# Altium schematic sheet MT-PowerDivider V1.0.0.SchDoc
size A2
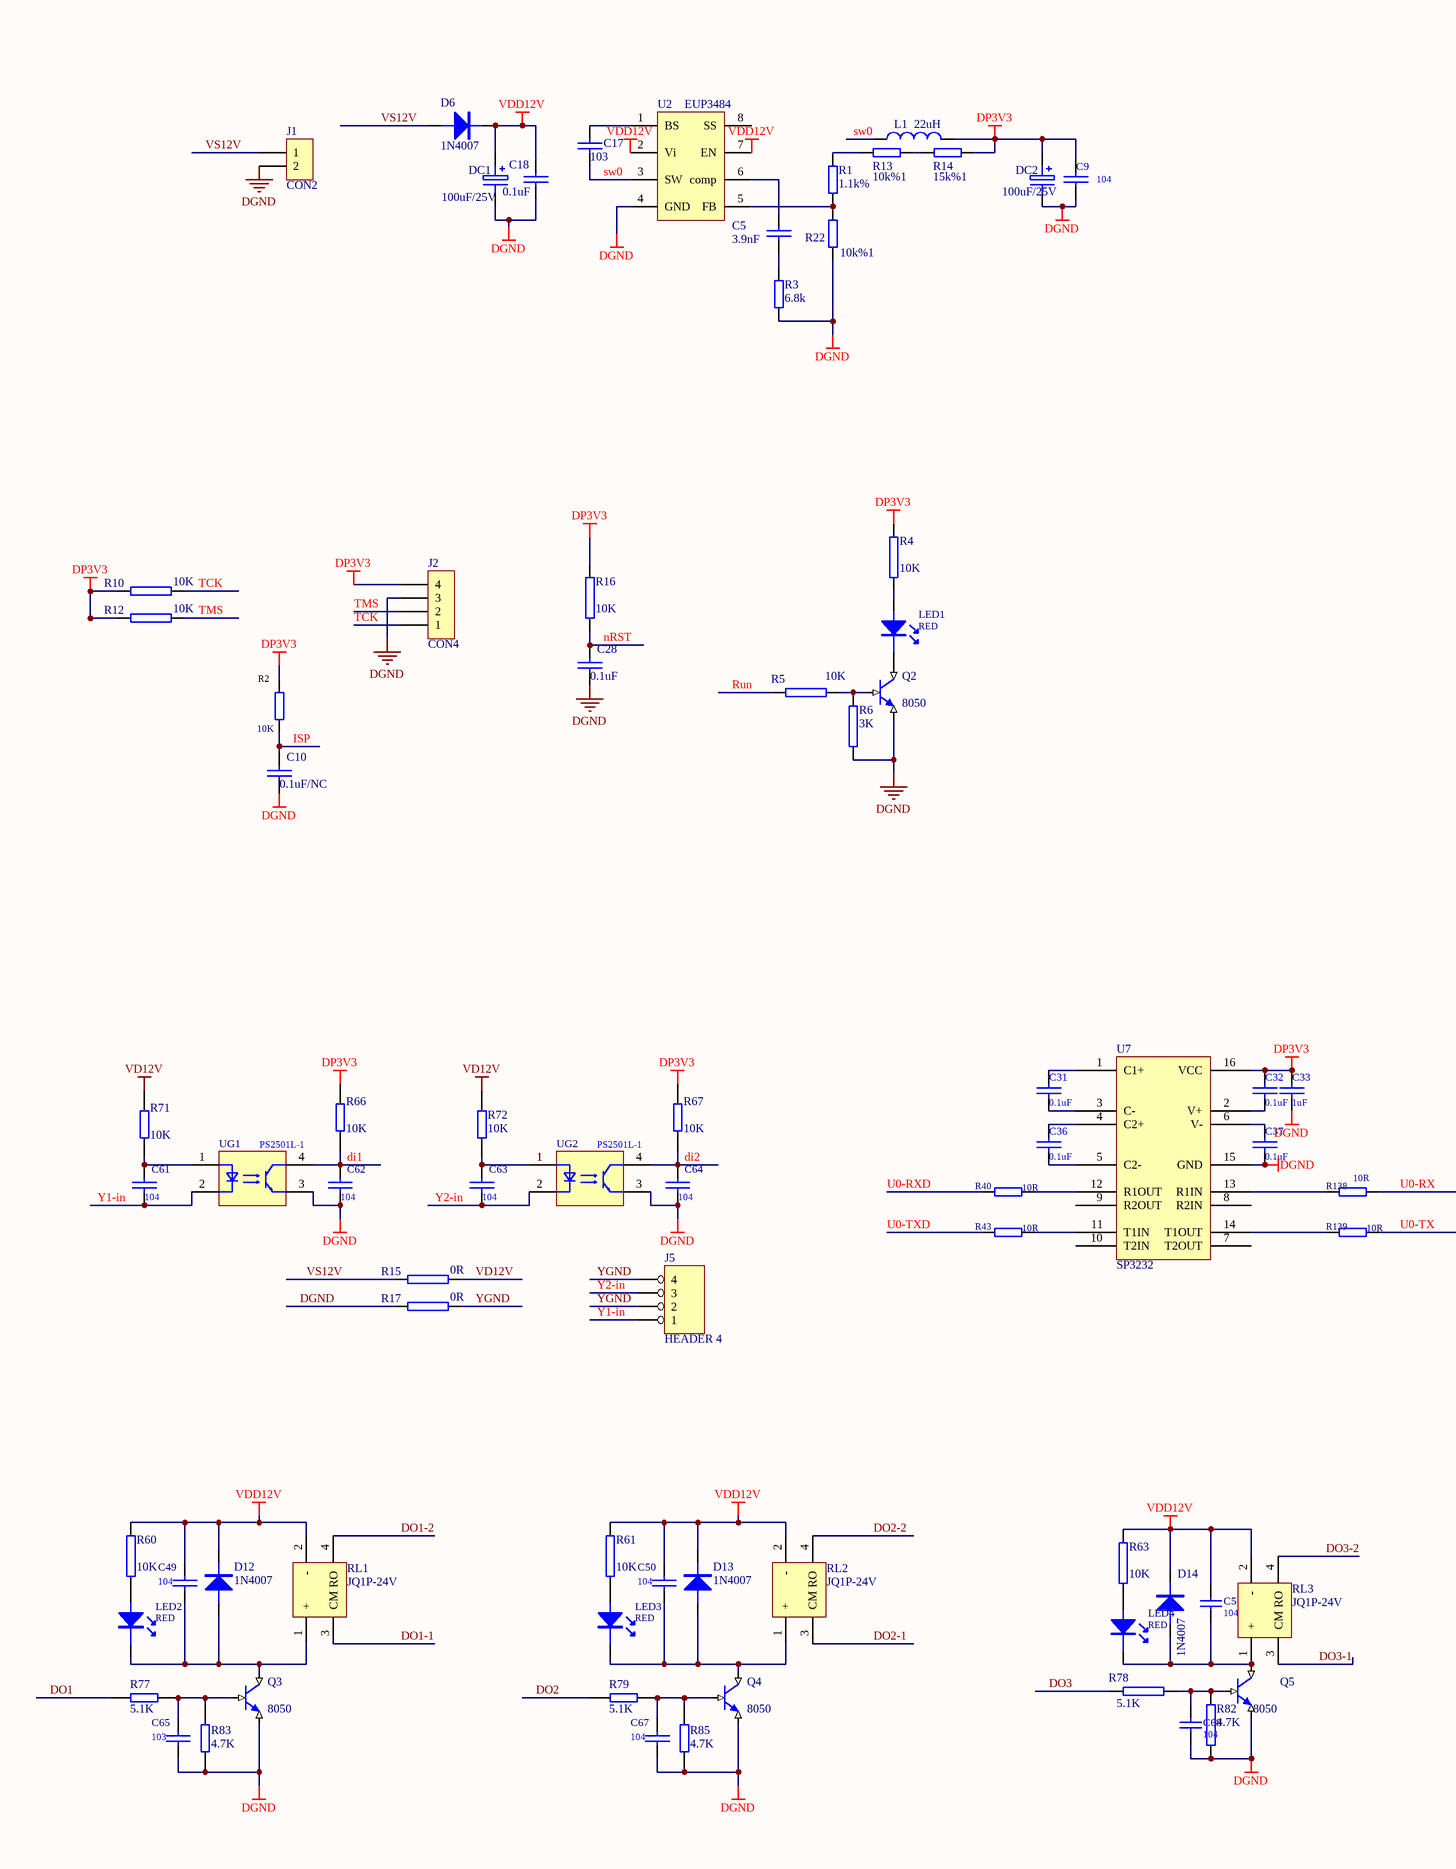
[diagram p0: MT-PowerDivider V1.0.0.SchDoc, left]
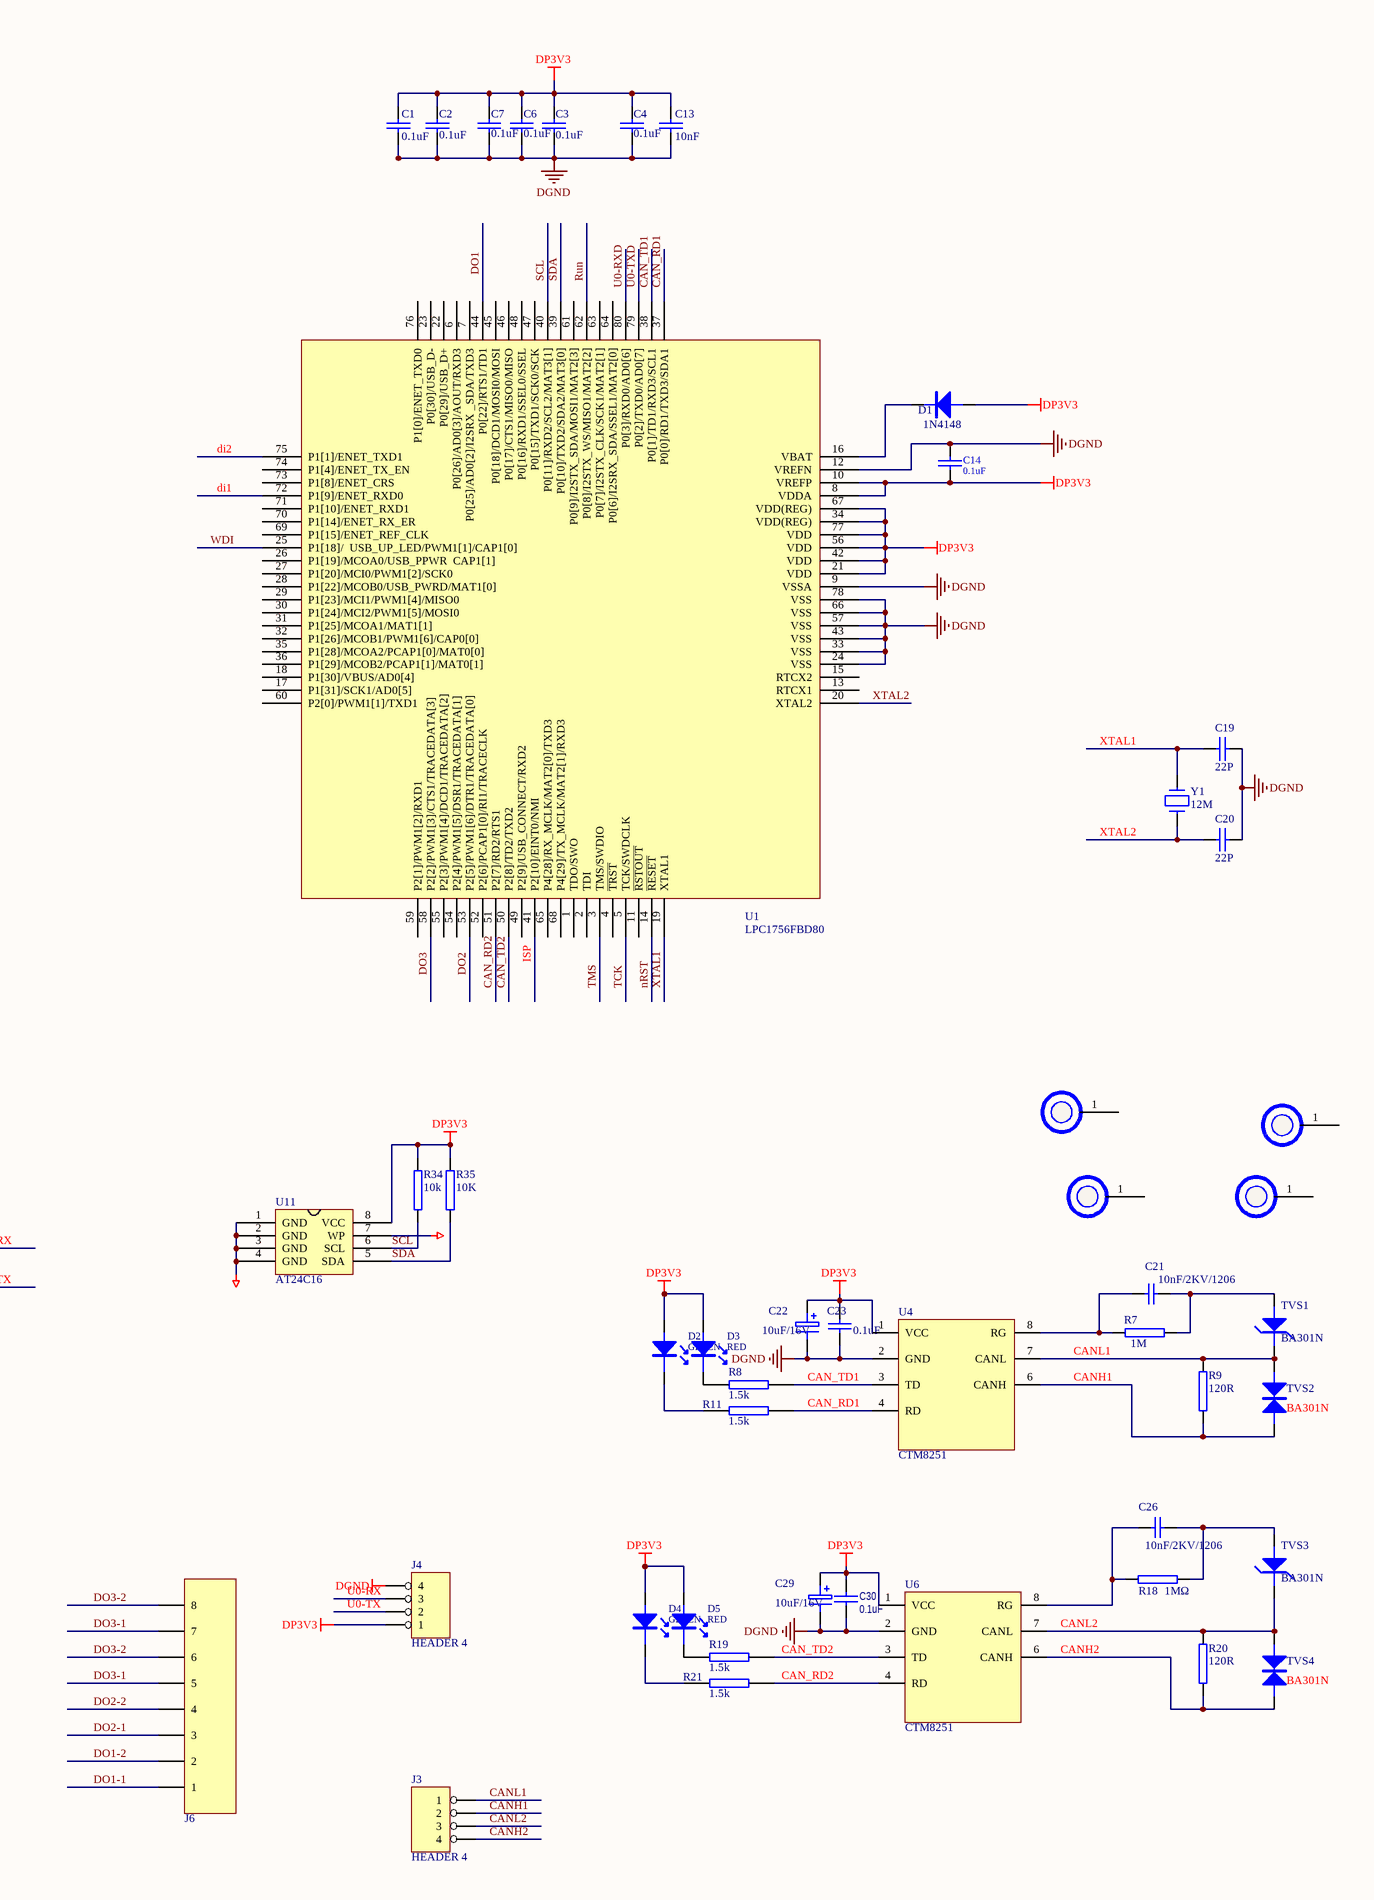
[diagram p1: MT-PowerDivider V1.0.0.SchDoc, right]

## Parts
5  (no value)  [HOLD-3.5MM]
6  (no value)  [HOLD-3.5MM]
7  (no value)  [HOLD-3.5MM]
8  (no value)  [HOLD-3.5MM]
C1  0.1uF  [0603C]
C2  0.1uF  [0603C]
C3  0.1uF  [0603C]
C4  0.1uF  [0603C]
C5  3.9nF  [0603C]
C6  0.1uF  [0603C]
C7  0.1uF  [0603C]
C9  104  [0603C]
C10  0.1uF/NC  [0603C]
C13  10nF  [0603C]
C14  0.1uF  [0603C]
C17  103  [0603C]
C18  0.1uF  [0805C]
C19  22P  [0603C]
C20  22P  [0603C]
C21  10nF/2KV/1206  [1206C]
C22  10uF/16V  [CA1206]
C23  0.1uF  [0603C]
C26  10nF/2KV/1206  [1206C]
C28  0.1uF  [0603C]
C29  10uF/16V  [CA1206]
C30  0.1uF  [0603C]
C31  0.1uF  [0603C]
C32  0.1uF  [0603C]
C33  1uF  [0603C]
C36  0.1uF  [0603C]
C37  0.1uF  [0603C]
C49  104  [0603C]
C50  104  [0603C]
C51  104  [0603C]
C61  104  [0603C]
C62  104  [0603C]
C63  104  [0603C]
C64  104  [0603C]
C65  103  [0603C]
C67  104  [0603C]
C68  104  [0603C]
D1  1N4148  [1206D]
D2  GREEN  [D0805]
D3  RED  [D0805]
D4  GREEN  [D0805]
D5  RED  [D0805]
D6  1N4007  [1206D]
D12  1N4007  [1206D]
D13  1N4007  [1206D]
D14  1N4007  [1206D]
DC1  100uF/25V  [C100UF16VEJ]
DC2  100uF/25V  [C100UF16VEJ]
J1  CON2  [KF2EDG-2P=3.81mm]
J2  CON4  [COM4-2.54mm-90]
J3  HEADER 4  [KF2EDG-4P-3.81mm]
J4  HEADER 4  [KF2EDG-4P-3.81mm]
J5  HEADER 4  [KF2EDG-4P-3.81mm]
J6  CON8  [KF2EDG-8P-3.81mm]  (value not drawn)
L1  22uH  [LC7*7*3_L]
LED1  RED  [D0805]
LED2  RED  [D0805]
LED3  RED  [D0805]
LED4  RED  [D0805]
Q2  8050  [SOT23]
Q3  8050  [SOT23]
Q4  8050  [SOT23]
Q5  8050  [SOT23]
R1  1.1k%  [0603R]
R2  10K  [0603R]
R3  6.8k  [0603R]
R4  10K  [0603R]
R5  10K  [0603R]
R6  3K  [0603R]
R7  1M  [1206R]
R8  1.5k  [0603R]
R9  120R  [1206R]
R10  10K  [0603R]
R11  1.5k  [0603R]
R12  10K  [0603R]
R13  10k%1  [0603R]
R14  15k%1  [0603R]
R15  0R  [0603R]
R16  10K  [0603R]
R17  0R  [0603R]
R18  value 1MΩ  [1206R]  (hidden comment: 1M)
R19  1.5k  [0603R]
R20  120R  [1206R]
R21  1.5k  [0603R]
R22  10k%1  [0603R]
R34  10k  [0603R]
R35  10K  [0603R]
R40  10R  [0603R]
R43  10R  [0603R]
R60  10K  [0603R]
R61  10K  [0603R]
R63  10K  [0603R]
R66  10K  [0603R]
R67  10K  [0603R]
R71  10K  [0603R]
R72  10K  [0603R]
R77  5.1K  [0603R]
R78  5.1K  [0603R]
R79  5.1K  [0603R]
R82  4.7K  [0603R]
R83  4.7K  [0603R]
R85  4.7K  [0603R]
R138  10R  [0603R]
R139  10R  [0603R]
RL1  JQ1P-24V  [HF32F-12V]
RL2  JQ1P-24V  [HF32F-12V]
RL3  JQ1P-24V  [HF32F-12V]
TVS1  BA301N  [3528TVS]
TVS2  BA301N  [3528TVS]
TVS3  BA301N  [3528TVS]
TVS4  BA301N  [3528TVS]
U1  LPC1756FBD80  [LQFP-80]
U2  EUP3484  [SOP8]
U4  CTM8251  [CTM8251KT]
U6  CTM8251  [CTM8251KT]
U7  SP3232  [SO-16]
U11  AT24C16  [SOP8]
UG1  PS2501L-1  [DIP-4]
UG2  PS2501L-1  [DIP-4]
Y1  12M  [ZS_SMD]

## Nets
DGND: C1.2 C2.2 C3.2 C4.2 C6.2 C7.2 C9.1 C10.1 C13.2 C14.1 C18.1 C19.2 C20.2 C22.2 C23.2 C28.1 C29.2 C30.1 C33.1 C37.1 C62.2 C64.2 C65.2 C67.2 C68.1 DC1.2 DC2.2 J1.2 J2.3 J4.4 Q2.3(E) Q3.3(E) Q4.3(E) Q5.3(E) R3.2 R6.1 R17.2 R22.2 R82.1 R83.1 R85.1 U1.9(VSSA) U1.12(VREFN) U1.24(VSS) U1.33(VSS) U1.43(VSS) U1.57(VSS) U1.66(VSS) U1.78(VSS) U2.4(GND) U4.2(GND) U6.2(GND) U7.15(GND) U11.1(GND) U11.2(GND) U11.3(GND) U11.4(GND) U11.7(WP) UG1.3 UG2.3
DP3V3: C1.1 C2.1 C3.1 C4.1 C6.1 C7.1 C9.2 C13.1 C14.2 C22.1 C23.1 C29.1 C30.2 C32.2 C33.2 D1.1(A) D2.1 D3.1 D4.1 D5.1 DC2.1 J2.4 J4.1 L1.2 R2.2 R4.2 R10.2 R12.2 R14.1 R16.1 R34.1 R35.1 R66.1 R67.1 U1.8(VDDA) U1.10(VREFP) U1.21(VDD) U1.34(VDD(REG)) U1.42(VDD) U1.56(VDD) U1.67(VDD(REG)) U1.77(VDD) U4.1(VCC) U6.1(VCC) U7.16(VCC) U11.8(VCC)
VD12V: R15.1 R71.1 R72.1
VDD12V: C18.2 C49.1 C50.1 C51.2 D6.2(K) D12.2(K) D13.2(K) D14.2(K) DC1.1 R60.2 R61.2 R63.2 RL1.2(-) RL2.2(-) RL3.2(-) U2.2(Vi) U2.7(EN)
CAN_RD1: R11.2 U1.37(P0[0]/RD1/TXD3/SDA1) U4.4(RD)
CAN_RD2: R21.2 U1.51(P2[7]/RD2/RTS1) U6.4(RD)
CAN_TD1: R8.2 U1.38(P0[1]/TD1/RXD3/SCL1) U4.3(TD)
CAN_TD2: R19.2 U1.50(P2[8]/TD2/TXD2) U6.3(TD)
CANH1: J3.2 R9.2 TVS2.1 U4.6(CANH)
CANH2: J3.4 R20.2 TVS4.1 U6.6(CANH)
CANL1: J3.1 R9.1 TVS1.2 TVS2.2 U4.7(CANL)
CANL2: J3.3 R20.1 TVS3.2 TVS4.2 U6.7(CANL)
di1: C62.1 R66.2 U1.72(P1[9]/ENET_RXD0) UG1.4
di2: C64.1 R67.2 U1.75(P1[1]/ENET_TXD1) UG2.4
DO1: R77.1 U1.44(P0[22]/RTS1/TD1)
DO1-1: J6.1 RL1.3(CM)
DO1-2: J6.2 RL1.4(RO)
DO2: R79.1 U1.53(P2[5]/PWM1[6]/DTR1/TRACEDATA[0])
DO2-1: J6.3 RL2.3(CM)
DO2-2: J6.4 RL2.4(RO)
DO3: R78.1 U1.58(P2[2]/PWM1[3]/CTS1/TRACEDATA[3])
DO3-1: J6.5 J6.7 RL3.3(CM)
DO3-2: J6.6 J6.8 RL3.4(RO)
ISP: C10.2 R2.1 U1.41(P2[10]/EINT0/NMI)
nRST: C28.2 R16.2 U1.14(~{RESET})
Run: R5.1 U1.62(P0[8]/I2STX_WS/MISO1/MAT2[2])
SCL: R34.2 U1.40(P0[11]/RXD2/SCL2/MAT3[1]) U11.6(SCL)
SDA: R35.2 U1.39(P0[10]/TXD2/SDA2/MAT3[0]) U11.5(SDA)
sw0: C17.1 L1.1 U2.3(SW)
TCK: J2.1 R10.1 U1.5(TCK/SWDCLK)
TMS: J2.2 R12.1 U1.3(TMS/SWDIO)
U0-RX: J4.3 R138.2
U0-RXD: R40.1 U1.80(P0[3]/RXD0/AD0[6])
U0-TX: J4.2 R139.2
U0-TXD: R43.1 U1.79(P0[2]/TXD0/AD0[7])
VS12V: D6.1(A) J1.1 R15.2
WDI: U1.25(P1[18]/__USB_UP_LED/PWM1[1]/CAP1[0])
XTAL1: C19.1 U1.19(XTAL1) Y1.2
XTAL2: C20.1 U1.20(XTAL2) Y1.1
Y1-in: C61.2 J5.1 UG1.2
Y2-in: C63.2 J5.3 UG2.2
YGND: J5.2 J5.4 R17.1
NetC5_1: C5.1 U2.6(comp)
NetC5_2: C5.2 R3.1
NetC17_2: C17.2 U2.1(BS)
NetC21_1: C21.1 R7.1 TVS1.1
NetC21_2: C21.2 R7.2 U4.8(RG)
NetC26_1: C26.1 R18.1 U6.8(RG)
NetC26_2: C26.2 R18.2 TVS3.1
NetC31_1: C31.1 U7.3(C-)
NetC31_2: C31.2 U7.1(C1+)
NetC32_1: C32.1 U7.2(V+)
NetC36_1: C36.1 U7.5(C2-)
NetC36_2: C36.2 U7.4(C2+)
NetC37_2: C37.2 U7.6(V-)
NetC49_2: C49.2 D12.1(A) LED2.2 Q3.2(C) RL1.1(+)
NetC50_2: C50.2 D13.1(A) LED3.2 Q4.2(C) RL2.1(+)
NetC51_1: C51.1 D14.1(A) LED4.2 Q5.2(C) RL3.1(+)
NetC61_1: C61.1 R71.2 UG1.1
NetC63_1: C63.1 R72.2 UG2.1
NetC65_1: C65.1 Q3.1(B) R77.2 R83.2
NetC67_1: C67.1 Q4.1(B) R79.2 R85.2
NetC68_2: C68.2 Q5.1(B) R78.2 R82.2
NetD1_2: D1.2(K) U1.16(VBAT)
NetD2_2: D2.2 R11.1
NetD3_2: D3.2 R8.1
NetD4_2: D4.2 R21.1
NetD5_2: D5.2 R19.1
NetLED1_1: LED1.1 R4.1
NetLED1_2: LED1.2 Q2.2(C)
NetLED2_1: LED2.1 R60.1
NetLED3_1: LED3.1 R61.1
NetLED4_1: LED4.1 R63.1
NetQ2_1: Q2.1(B) R5.2 R6.2
NetR1_1: R1.1 R13.2
NetR1_2: R1.2 R22.1 U2.5(FB)
NetR13_1: R13.1 R14.2
NetR40_2: R40.2 U7.12(R1OUT)
NetR43_2: R43.2 U7.11(T1IN)
NetR138_1: R138.1 U7.13(R1IN)
NetR139_1: R139.1 U7.14(T1OUT)

Not connected (* = marked no-connect by the designer): 5 1(HOLD); 6 1(HOLD); 7 1(HOLD); 8 1(HOLD); U1 1(TDO/SWO) 2(TDI) 4(~{TRST}) 6(P0[26]/AD0[3]/AOUT/RXD3) 7(P0[25]/AD0[2]/I2SRX__SDA/TXD3) 11(~{RSTOUT}) 13(RTCX1) 15(RTCX2) 17(P1[31]/SCK1/AD0[5]) 18(P1[30]/VBUS/AD0[4]) 22(P0[29]/USB_D+) 23(P0[30]/USB_D-) 26(P1[19]/MCOA0/USB_PPWR__CAP1[1]) 27(P1[20]/MCI0/PWM1[2]/SCK0) 28(P1[22]/MCOB0/USB_PWRD/MAT1[0]) 29(P1[23]/MCI1/PWM1[4]/MISO0) 30(P1[24]/MCI2/PWM1[5]/MOSI0) 31(P1[25]/MCOA1/MAT1[1]) 32(P1[26]/MCOB1/PWM1[6]/CAP0[0]) 35(P1[28]/MCOA2/PCAP1[0]/MAT0[0]) 36(P1[29]/MCOB2/PCAP1[1]/MAT0[1]) 45(P0[18]/DCD1/MOSI0/MOSI) 46(P0[17]/CTS1/MISO0/MISO) 47(P0[15]/TXD1/SCK0/SCK) 48(P0[16]/RXD1/SSEL0/SSEL) 49(P2[9]/USB_CONNECT/RXD2) 52(P2[6]/PCAP1[0]/RI1/TRACECLK) 54(P2[4]/PWM1[5]/DSR1/TRACEDATA[1]) 55(P2[3]/PWM1[4]/DCD1/TRACEDATA[2]) 59(P2[1]/PWM1[2]/RXD1) 60(P2[0]/PWM1[1]/TXD1) 61(P0[9]/I2STX_SDA/MOSI1/MAT2[3]) 63(P0[7]/I2STX_CLK/SCK1/MAT2[1]) 64(P0[6]/I2SRX_SDA/SSEL1/MAT2[0]) 65(P4[28]/RX_MCLK/MAT2[0]/TXD3) 68(P4[29]/TX_MCLK/MAT2[1]/RXD3) 69(P1[15]/ENET_REF_CLK) 70(P1[14]/ENET_RX_ER) 71(P1[10]/ENET_RXD1) 73(P1[8]/ENET_CRS) 74(P1[4]/ENET_TX_EN) 76(P1[0]/ENET_TXD0); U2 8(SS); U7 7(T2OUT) 8(R2IN) 9(R2OUT) 10(T2IN)

## Library data of the parts
5-8 = HOLD_5X9MM
C1-C4 C6 C7 C13 C19 C20 = CAP1
C5 C17 C18 = CAP
C9 C23 C30-C33 C36 C37 C49 C50 C61-C65 C67 = CAP: Capacitor
C10 C28 = CAP1: CAP
C14 = CAP_3: Capacitor
C21 C26 = 0.1uF: C0603; Published: *; LatestRevisionDate: *; LatestRevisionNote: *; Publisher: *; Value: *
C22 C29 DC1 DC2 = CAP2
C51 C68 = Cap: Capacitor; Published: *; LatestRevisionDate: *; LatestRevisionNote: *; PackageReference: *; Publisher: *; Value: *
D1 D6 D12-D14 = DIODE
D2-D5 LED1-LED4 = LED
J2 = CON4: Connector
J3-J5 = 4 HEADER: 4 Pin Header
L1 = INDUCTOR
Q2-Q5 = NPN
R1 R3 R13 R14 R22 = R_S
R2 R40 R43 R138 R139 = RES-1: RES
R4-R6 R10 R12 R15-R17 R60 R61 R63 R66 R67 R71 R72 R77-R79 R82 R83 R85 = RES1
R7-R9 R11 R19-R21 = RES2
  R7: 物?: *; Value: 1M; 规: *; RoHS: *; 贴?: *; ComponentLink1Description: *; ComponentLink1URL: *; 现?: *
  R9 R20: 物?: *; Value: 120R; 规: *; RoHS: *; 贴?: *; ComponentLink1Description: *; ComponentLink1URL: *; 现?: *
R18 = RES2: 物?: 1.01.03.0019; ?: 1MΩ,1206,RoHS; 贴?: SMT; 现?: 16230; RoHS: RoHS; ComponentLink1Description: ErpDataInfo; ComponentLink1URL: http://192.168.0.2:8012/ErpExt/ErpData/ListMateriel.aspx?pkey=1.01.03.0019
R34 R35 = RES1: 0603贴片电阻/10K/0.1W/±5%
RL1-RL3 = JQ1P-12V
TVS1 TVS3 = TVS-D
TVS2 TVS4 = TVS
U1 = LPC1756FBD80: LPC1756FBD80,LQFP-80_12x12x05P,NXP
U7 = MAX232ESE
U11 = AT24C64: EEPROM/64K/2.7V/SOP8/ATMEL
UG1 UG2 = PS2501-1
Y1 = CRYSTAL